# Altium schematic sheet accesory.SchDoc
size A4
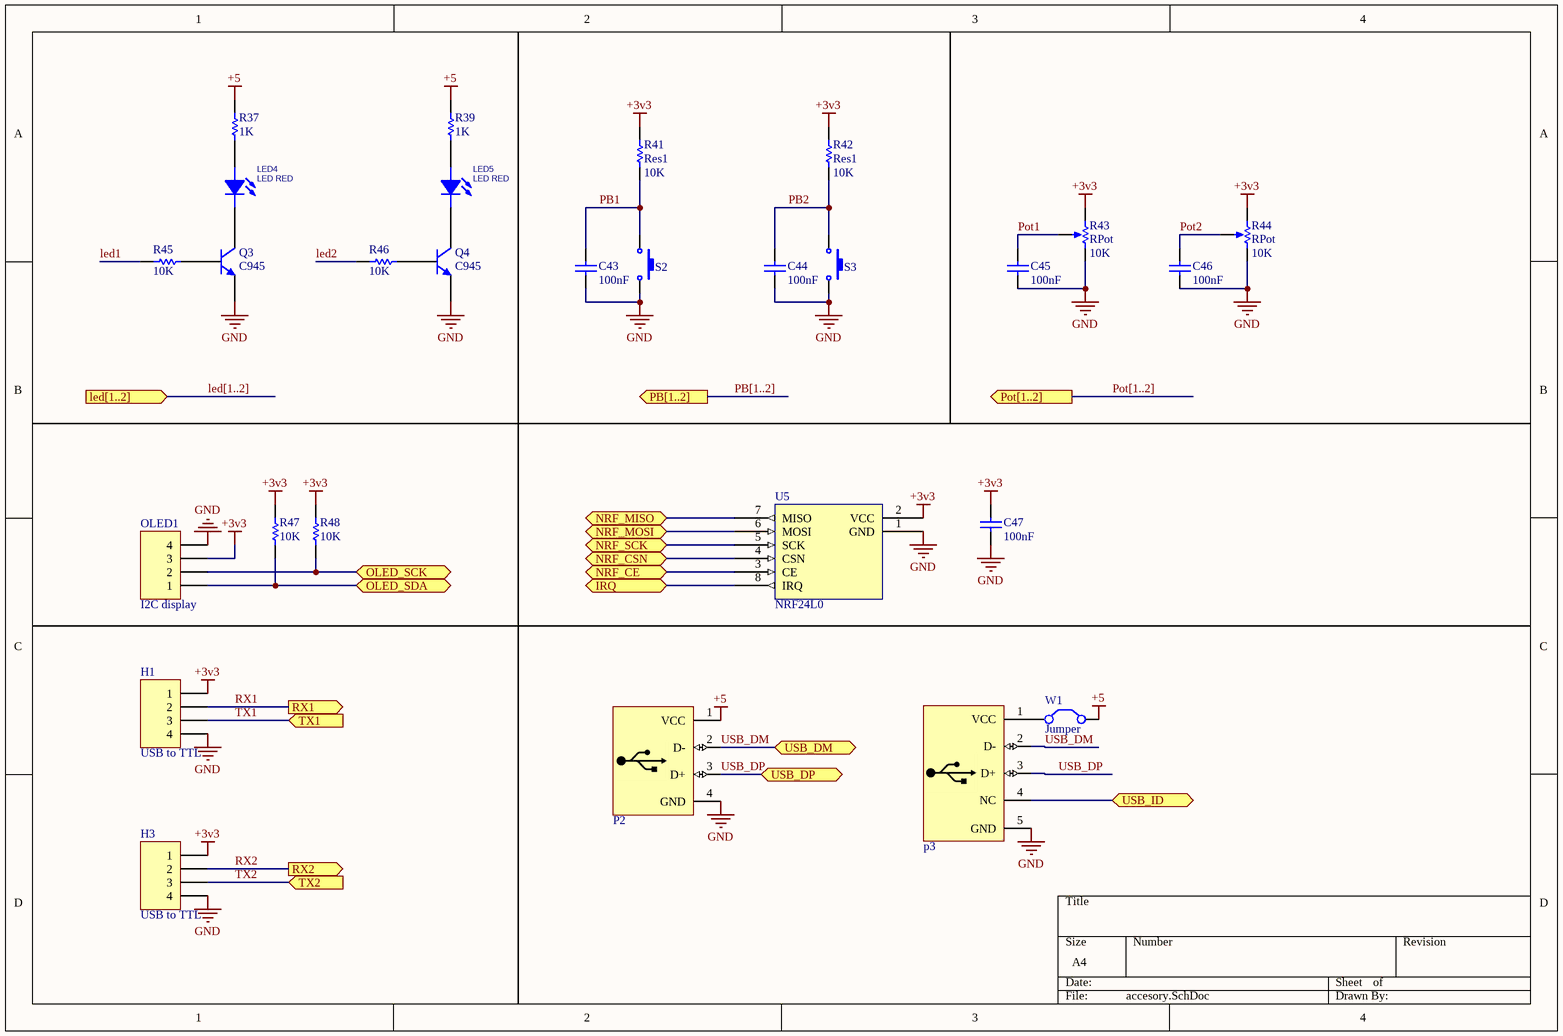
[diagram p0: accesory.SchDoc]

## Parts
C43  value 100nF  [SMD_CAP_0805]  (hidden comment: Cap)
C44  value 100nF  [SMD_CAP_0805]  (hidden comment: Cap)
C45  value 100nF  [SMD_CAP_0805]  (hidden comment: Cap)
C46  value 100nF  [SMD_CAP_0805]  (hidden comment: Cap)
C47  value 100nF  [SMD_CAP_0805]  (hidden comment: Cap)
H1  USB to TTL  [HDR1X4]
H3  USB to TTL  [HDR1X4]
LED4  LED RED  [led_0805]
LED5  LED RED  [led_0805]
OLED1  I2C display  [HDR1X4]
P2  USB Connector  [USB2.5-2H4C]  (value not drawn)
p3  USB Connector  [USB_AB_BM_SHS]  (value not drawn)
Q3  C945  [SOT23_N]
Q4  C945  [SOT23_N]
R37  1K  [RES 0805 (2012X06L)]
R39  1K  [RES 0805 (2012X06L)]
R41  Res1  value 10K  [RES 0805 (2012X06L)]
R42  Res1  value 10K  [RES 0805 (2012X06L)]
R43  RPot  value 10K  [Multi Turn 02]
R44  RPot  value 10K  [Multi Turn 02]
R45  value 10K  [RES 0805 (2012X06L)]  (hidden comment: Res1)
R46  value 10K  [RES 0805 (2012X06L)]  (hidden comment: Res1)
R47  value 10K  [RES 0805 (2012X06L)]  (hidden comment: Res1)
R48  value 10K  [RES 0805 (2012X06L)]  (hidden comment: Res1)
S2  Switch PB  [Switch - Push to On]  (value not drawn)
S3  Switch PB  [Switch - Push to On]  (value not drawn)
U5  NRF24L0  [RF24-MICRO STRIP]
W1  Jumper  [Jumper SMD]

## Ports
IRQ (bidir), led[1..2] (in), NRF_CE (bidir), NRF_CSN (bidir), NRF_MISO (bidir), NRF_MOSI (bidir), NRF_SCK (bidir), OLED_SCK (bidir), OLED_SDA (bidir), PB[1..2] (out), Pot[1..2] (out), RX1 (out), RX2 (out), TX1 (in), TX2 (in), USB_DM (bidir), USB_DP (bidir), USB_ID (bidir)

## Nets
+3v3: C47.2 H1.1 H3.1 OLED1.3 R41.1 R42.1 R43.1(TOP) R44.1(TOP) R47.2 R48.2 U5.2(VCC)
+5: P2.1(VCC) R37.2 R39.2 W1.2(C2)
GND: C43.1 C44.1 C45.1 C46.1 C47.1 H1.4 H3.4 OLED1.4 P2.4(GND) p3.5(GND) Q3.2(E) Q4.2(E) R43.2(BOT) R44.2(BOT) S2.2 S3.2 U5.1(GND)
IRQ: U5.8(IRQ) ; port IRQ
led1: R45.1
led2: R46.1
NRF_CE: U5.3(CE) ; port NRF_CE
NRF_CSN: U5.4(CSN) ; port NRF_CSN
NRF_MISO: U5.7(MISO) ; port NRF_MISO
NRF_MOSI: U5.6(MOSI) ; port NRF_MOSI
NRF_SCK: U5.5(SCK) ; port NRF_SCK
OLED_SCK: OLED1.2 R48.1 ; port OLED_SCK
OLED_SDA: OLED1.1 R47.1 ; port OLED_SDA
PB1: C43.2 R41.2 S2.1
PB2: C44.2 R42.2 S3.1
Pot1: C45.2 R43.3(TAP)
Pot2: C46.2 R44.3(TAP)
RX1: H1.2 ; port RX1
RX2: H3.2 ; port RX2
TX1: H1.3 ; port TX1
TX2: H3.3 ; port TX2
USB_DM: P2.2(D-) p3.2(D-) ; port USB_DM
USB_DP: P2.3(D+) p3.3(D+) ; port USB_DP
USB_ID: p3.4(NC) ; port USB_ID
NetLED4_1: LED4.1(ANODE) R37.1
NetLED4_2: LED4.2(CATHODE) Q3.3(C)
NetLED5_1: LED5.1(ANODE) R39.1
NetLED5_2: LED5.2(CATHODE) Q4.3(C)
Netp3_1: p3.1(VCC) W1.1(C1)
NetQ3_1: Q3.1(B) R45.2
NetQ4_1: Q4.1(B) R46.2

## Buses and harness runs
bus led[1..2] = port led[1..2]
bus PB[1..2] = port PB[1..2]
bus Pot[1..2] = port Pot[1..2]

## Library data of the parts
C43-C47 = Cap: Capacitor; Published: 8-Jun-2000; LatestRevisionDate: 17-Jul-2002; LatestRevisionNote: Re-released for DXP Platform.; PackageReference: RAD-0.3; Publisher: Altium Limited; PackageDescription: Radial Cap, Thru-Hole; 2 Leads; 0.3 in Pin Spacing
H1 H3 = H-1x4
LED4 LED5 = LED 5MM: Light Emitting Diode; Designer: Abbas Basereh; Data: 16-12-2016; Link: *; Part.No: *
OLED1 = Header 4: Header, 4-Pin; LatestRevisionDate: 17-Jul-2002; LatestRevisionNote: Re-released for DXP Platform.; Publisher: Altium Limited
P2 = USB A-Type: USB Connector-A Type
p3 = USB MICRO: USB Connector MICRO-B Type; Designer: ABBAS BASEREH; Max Current: 1600mA; Mounting Technology: Surface Mount\Through-Hole; Category: Connector; Pin Count: 5-7; Publisher: ABBAS BASEREH; Status: Unreleased; ComponentLink1Description: Datasheet; ComponentLink2Description: Reference; Update: 1395-11-17
Q3 Q4 = C945: NPN Silicon Epitaxial Planar Transistor; Published: 2017-2-8; LatestRevisionDate: 2017; LatestRevisionNote: IPC-7351 Footprint Added.; DatasheetVersion: 2017; PackageVersion: 2017-2-8; PackageReference: SOT23; Publisher: Abbas Basereh; PackageDescription: 3-Pin SOT-23 Package 0.95 mm Pitch, 2.3 mm Lead Span; ComponentLink1Description: Manufacturer Link; ComponentLink1URL: http://www.taitroncomponents.com/; ComponentLink2Description: Datasheet; ComponentLink2URL: http://www.taitroncomponents.com/
R37 R39 = RES Axial 0.25W: Designer: Abbas Basereh; Desc.: RES Axial 0.25W; Data: 4-1-2017
R41 R42 R45-R48 = Res1: Resistor; Published: 8-Jun-2000; LatestRevisionDate: 17-Jul-2002; LatestRevisionNote: Re-released for DXP Platform.; PackageReference: AXIAL-0.3; Publisher: Altium Limited; PackageDescription: Axial Device, Thru-Hole; 2 Leads; 0.3 in Pin Spacing
R43 R44 = RPot: Potentiometer; Sim Note: Enter the Resistance value and the set point into parameter fields.; Set Position: 0.5; Published: 8-Jun-2000; LatestRevisionDate: 17-Jul-2002; LatestRevisionNote: Re-released for DXP Platform.; PackageReference: VR5; Publisher: Altium Limited; PackageDescription: Variable Resistor, Thru-Hole; 3 Leads
S2 S3 = Switch PB: Push Button Switch
U5 = NRF24
W1 = Jumper: Jumper Wire; Published: 24-Mar-1999; LatestRevisionDate: 17-Jul-2002; LatestRevisionNote: Re-released for DXP Platform.; PackageReference: RAD-0.2; Publisher: Altium Limited; PackageDescription: Radial Cap, Thru-Hole; 2 Leads; 0.2 in Pin Spacing